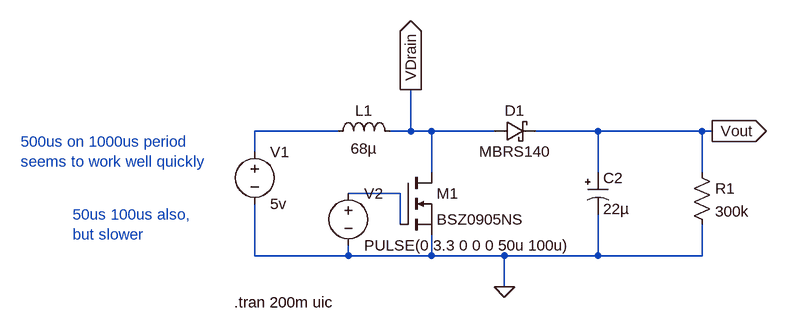
[diagram p0: schematic test boost.asc]
test boost.asc, the LTspice schematic file:
Version 4
SHEET 1 920 680
WIRE 80 -32 -48 -32
WIRE 192 -32 192 -96
WIRE 192 -32 160 -32
WIRE 224 -32 192 -32
WIRE 320 -32 224 -32
WIRE 480 -32 384 -32
WIRE 640 -32 480 -32
WIRE 656 -32 640 -32
WIRE -48 0 -48 -32
WIRE 224 32 224 -32
WIRE 480 32 480 -32
WIRE 640 32 640 -32
WIRE 176 64 96 64
WIRE 176 112 176 64
WIRE -48 160 -48 80
WIRE 96 160 96 144
WIRE 96 160 -48 160
WIRE 224 160 224 128
WIRE 224 160 96 160
WIRE 336 160 224 160
WIRE 480 160 480 96
WIRE 480 160 336 160
WIRE 640 160 640 112
WIRE 640 160 480 160
WIRE 336 208 336 160
FLAG 336 208 0
FLAG 192 -96 VDrain
IOPIN 192 -96 Out
FLAG 656 -32 Vout
IOPIN 656 -32 Out
SYMBOL ind 64 -16 R270
WINDOW 0 32 56 VTop 2
WINDOW 3 5 56 VBottom 2
SYMATTR InstName L1
SYMATTR Value 68µ
SYMBOL nmos 176 32 R0
SYMATTR InstName M1
SYMATTR Value BSZ0905NS
SYMBOL schottky 320 -16 R270
WINDOW 0 32 32 VTop 2
WINDOW 3 0 32 VBottom 2
SYMATTR InstName D1
SYMATTR Value MBRS140
SYMATTR Description Diode
SYMATTR Type diode
SYMBOL res 624 16 R0
SYMATTR InstName R1
SYMATTR Value 300k
SYMATTR SpiceLine tol=5 pwr=.25w
SYMBOL voltage -48 -16 R0
WINDOW 123 0 0 Left 0
WINDOW 39 0 0 Left 0
SYMATTR InstName V1
SYMATTR Value 5v
SYMBOL voltage 96 48 R0
WINDOW 123 0 0 Left 0
WINDOW 39 0 0 Left 0
SYMATTR InstName V2
SYMATTR Value PULSE(0 3.3 0 0 0 50u 100u)
SYMBOL polcap 464 32 R0
WINDOW 3 24 56 Left 2
SYMATTR Value 22µ
SYMATTR InstName C2
SYMATTR Description Capacitor
SYMATTR Type cap
SYMATTR SpiceLine V=400 Irms=162m Rser=0.408322 Lser=4.41071n mfg="Würth Elektronik" pn="860021375012 WCAP-ATG5 10x25" type="Al electrolytic"
TEXT -80 232 Left 2 !.tran 200m uic
TEXT -408 -16 Left 2 ;500us on 1000us period \nseems to work well quickly
TEXT -328 96 Left 2 ;50us 100us also,\nbut slower

The netlist it stands for:
* test boost.asc
L1 N001 VDrain 68µ
M1 VDrain N002 0 0 BSZ0905NS
D1 VDrain Vout MBRS140
R1 Vout 0 300k tol=5 pwr=.25w
V1 N001 0 5v
V2 N002 0 PULSE(0 3.3 0 0 0 50u 100u)
C2 Vout 0 22µ V=400 Irms=162m Rser=0.408322 Lser=4.41071n mfg="Würth Elektronik" pn="860021375012 WCAP-ATG5 10x25" type="Al electrolytic"
.model D D
.lib standard.dio
.model NMOS NMOS
.model PMOS PMOS
.lib standard.mos
.tran 200m uic
* 500us on 1000us period
* seems to work well quickly
* 50us 100us also,
* but slower
.backanno
.end